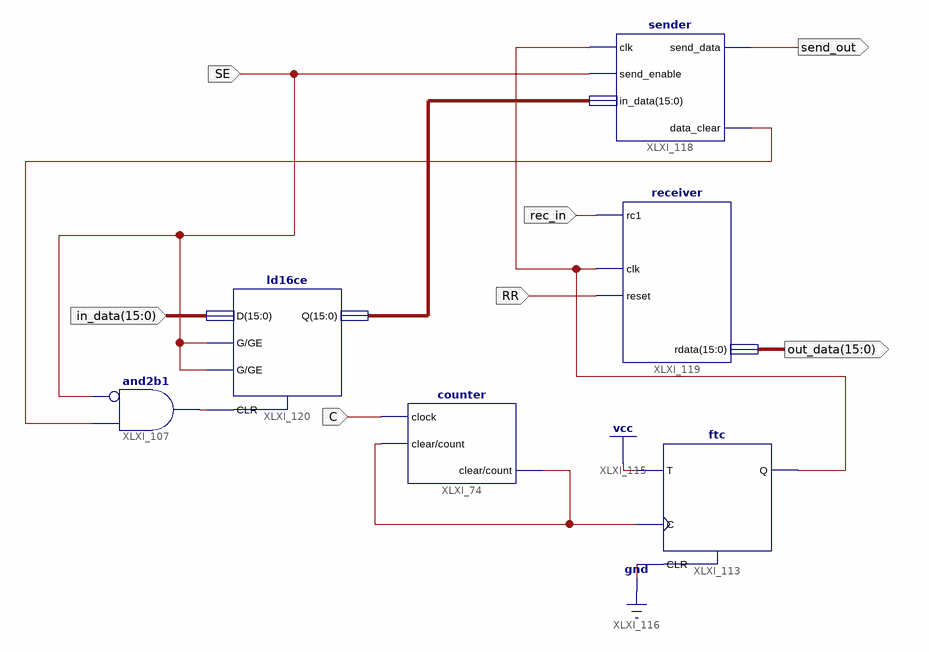
[diagram p0: schematic sheet 1]
// Xilinx ISE schematic tfr.sch (spartan6) as structural Verilog: 6 symbols, 7 ports
module tfr (
  input  [15:0] in_data,
  input  C,
  input  RR,
  input  SE,
  input  rec_in,
  output send_out,
  output [15:0] out_data
);

  wire send_clear, slowclk, slowcount, XLXN_236;
  wire [15:0] XLXN_234;

  and XLXI_107 (XLXN_236, ~SE, send_clear);  // and2b1
  counter XLXI_74 (.clock(C), .clear(slowcount), .count(slowcount));
  ftc XLXI_113 (.C(slowcount), .CLR(1'b0), .T(1'b1), .Q(slowclk));
  sender XLXI_118 (.clk(slowclk), .send_enable(SE), .in_data(XLXN_234), .data_clear(send_clear), .send_data(send_out));
  receiver XLXI_119 (.rc1(rec_in), .reset(RR), .clk(slowclk), .rdata(out_data));
  ld16ce XLXI_120 (.CLR(XLXN_236), .D(in_data), .G(SE), .GE(SE), .Q(XLXN_234));
endmodule
